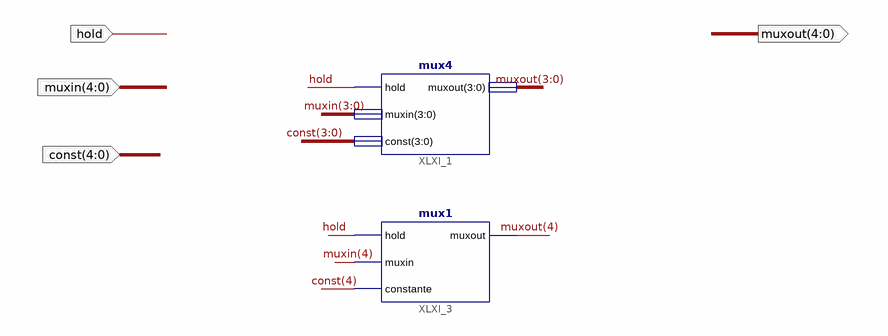
[diagram p0: schematic sheet 1]
// Xilinx ISE schematic mux5.sch (artix7) as structural Verilog: 2 symbols, 4 ports
module mux5 (
  input  [4:0] muxin,
  input  hold,
  input  [4:0] \const ,
  output [4:0] muxout
);

  mux4 XLXI_1 (.hold(hold), .muxin(muxin[3:0]), .\const (\const [3:0]), .muxout(muxout[3:0]));
  mux1 XLXI_3 (.hold(hold), .muxin(muxin[4]), .constante(\const [4]), .muxout(muxout[4]));
endmodule
